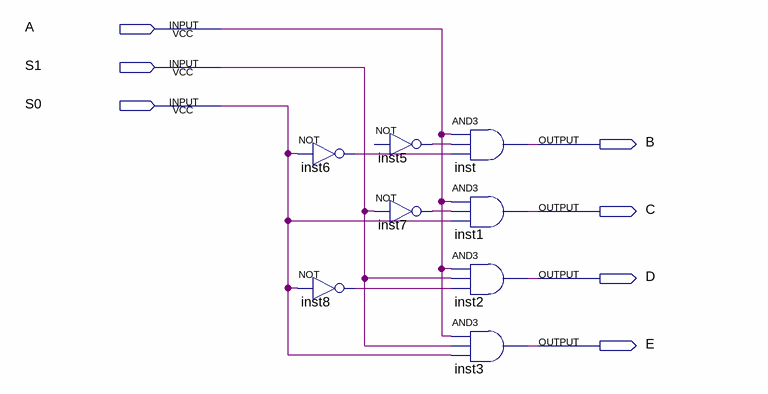
[diagram p0: schematic sheet]
// Quartus schematic Lab1.bdf as structural Verilog: 8 symbols, 7 pins
module Lab1 (
  input  A,
  input  S1,
  input  S0,
  output B,
  output C,
  output D,
  output E
);

  wire inst5_out, inst6_out, inst7_out, inst8_out;

  not inst6 (inst6_out, S0);
  not inst8 (inst8_out, S0);
  // NOT inst5 has open pins: IN=open, OUT=inst5_out
  not inst7 (inst7_out, S1);
  and inst (B, A, inst5_out, inst6_out);
  and inst1 (C, A, inst7_out, S0);
  and inst2 (D, A, S1, inst8_out);
  and inst3 (E, A, S1, S0);
endmodule
